# Altium schematic sheet Sheet1.SchDoc
size B
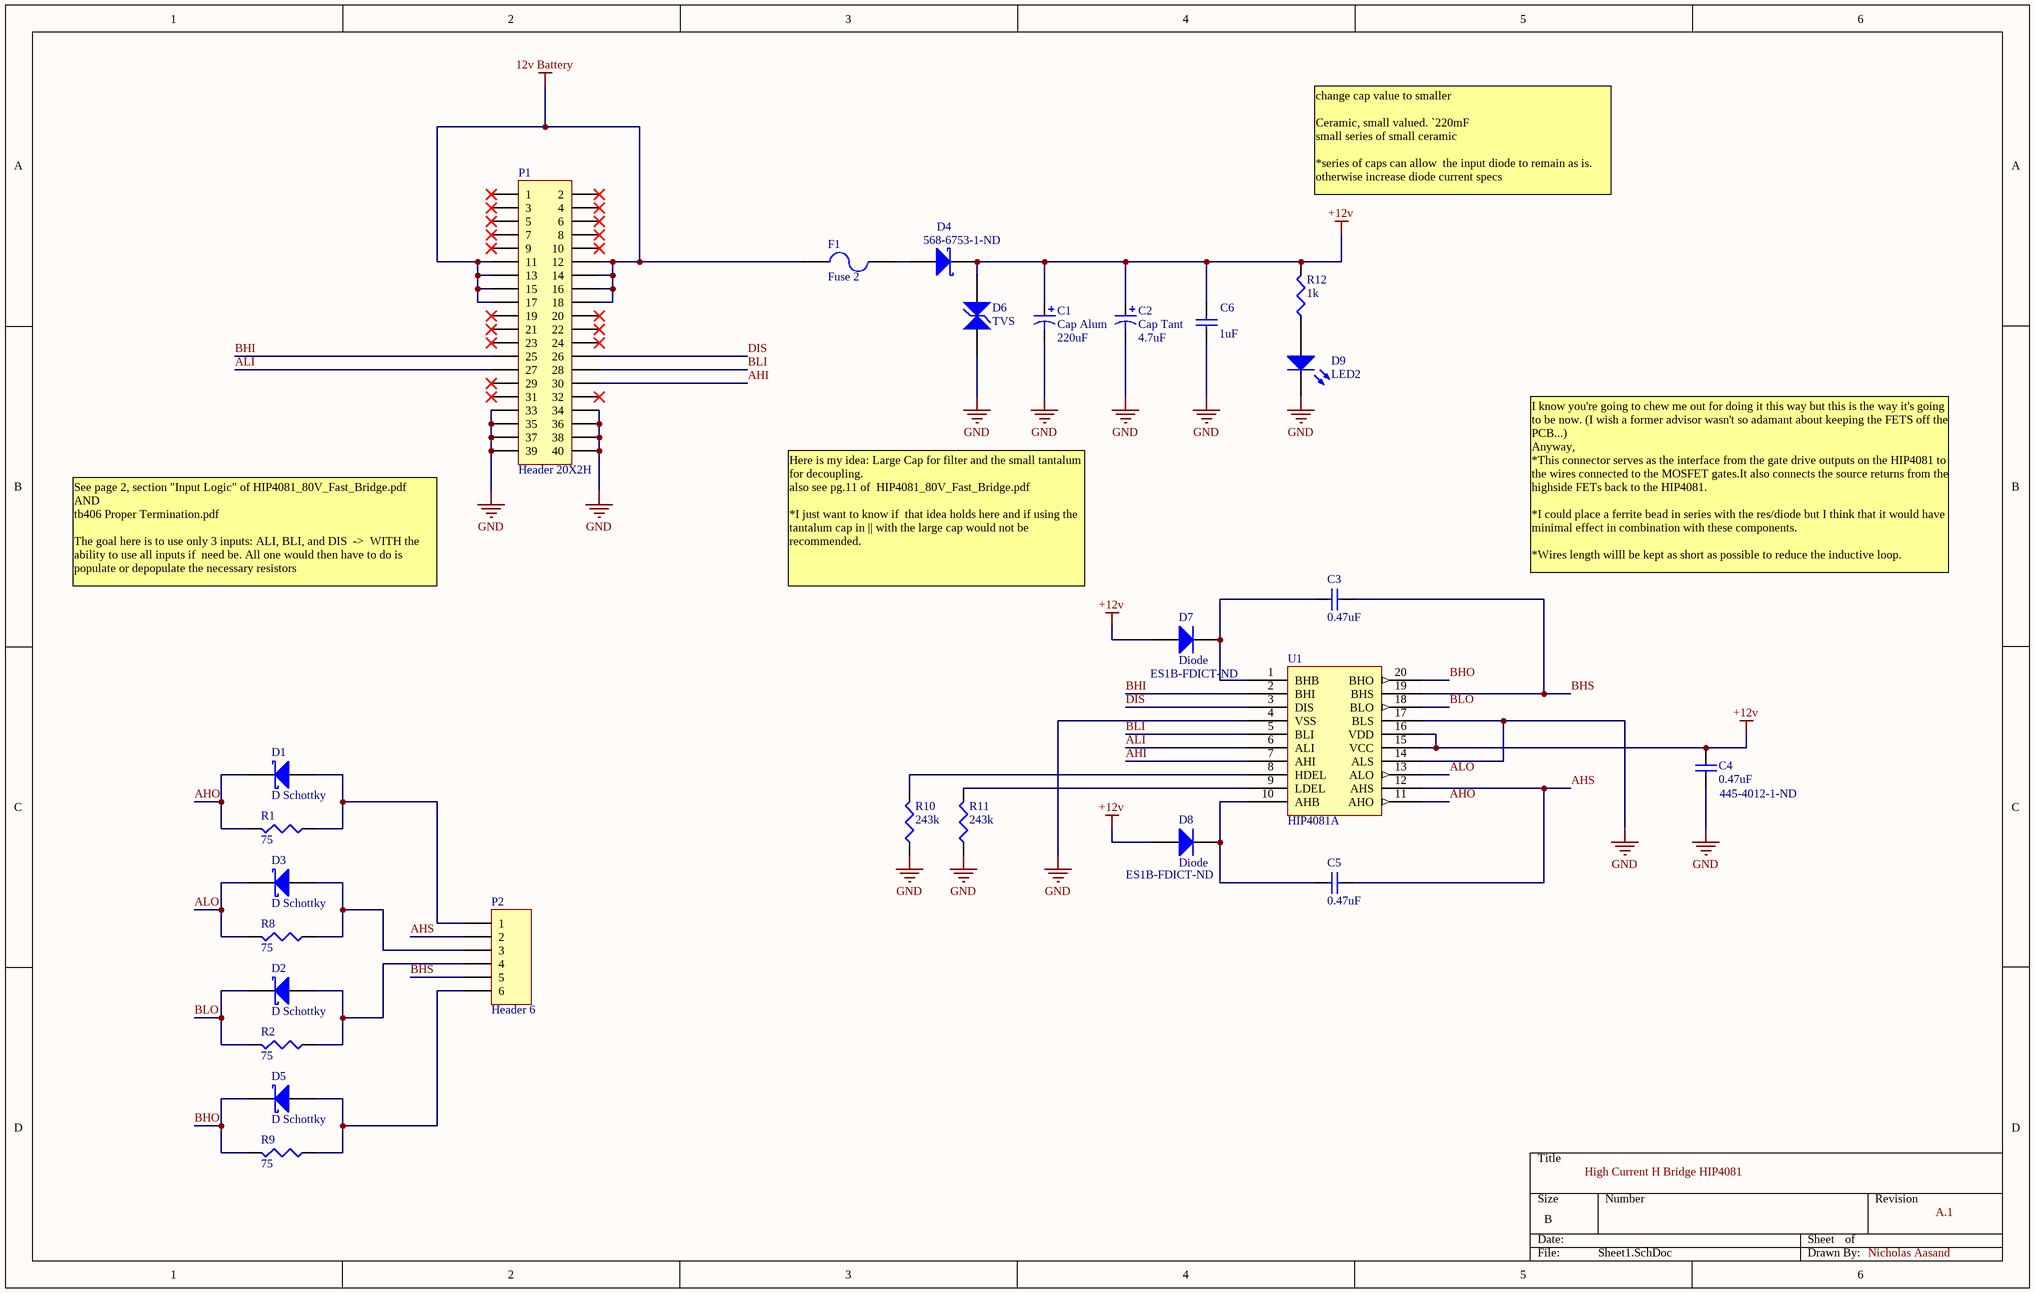
[diagram p0: Sheet1.SchDoc]

## Parts
C1  Cap Alum  value 220uF  [CAPPR3.5-8x11.5]
C2  Cap Tant  value 4.7uF  [CP1206]
C3  value 0.47uF  [C0805]  (hidden comment: 0805)
C4  value 0.47uF  Digikey: 445-4012-1-ND  [C1206]  (hidden comment: 0805)
C5  value 0.47uF  [C0805]  (hidden comment: 0805)
C6  value 1uF  [C0805]  (hidden comment: 0805)
D1  D Schottky  [SMB]
D2  D Schottky  [SMB]
D3  D Schottky  [SMB]
D4  Digikey: 568-6753-1-ND  [SOD128]  (hidden comment: PMEG3030EP,115)
D5  D Schottky  [SMB]
D6  TVS  [DSO-C2/X3.3]
D7  Diode  Digikey: ES1B-FDICT-ND  [DSO-C2/G1.6]
D8  Diode  Digikey: ES1B-FDICT-ND  [DSO-C2/G1.6]
D9  LED2  [C0805]
F1  Fuse 2  [3550-2 ATC Fuse Holder]
P1  Header 20X2H  [HDR2X20H]
P2  Header 6  [B6PS-VH]
R1  value 75  [RESC3216N]  (hidden comment: 1206)
R2  value 75  [RESC3216N]  (hidden comment: 1206)
R8  value 75  [RESC3216N]  (hidden comment: 1206)
R9  value 75  [RESC3216N]  (hidden comment: 1206)
R10  value 243k  [C1206]  (hidden comment: 1206)
R11  value 243k  [C1206]  (hidden comment: 1206)
R12  value 1k  [RESC3216N]  (hidden comment: 1206)
U1  HIP4081A  [SOIC127P1030-20M]

## Nets
12v Battery: F1.1 P1.11 P1.12 P1.13 P1.14 P1.15 P1.16 P1.17 P1.18
+12v: C1.1 C2.1 C4.1 C6.2 D4.2(K) D6.1 D7.1(A) D8.1(A) R12.2 U1.15(VCC) U1.16(VDD)
GND: C1.2 C2.2 C4.2 C6.1 D6.2 D9.2(K) P1.33 P1.34 P1.35 P1.36 P1.37 P1.38 P1.39 P1.40 R10.1 R11.1 U1.4(VSS) U1.14(ALS) U1.17(BLS)
AHI: P1.30 U1.7(AHI)
AHO: D1.2(K) R1.2 U1.11(AHO)
AHS: C5.1 P2.2 U1.12(AHS)
ALI: P1.27 U1.6(ALI)
ALO: D3.2(K) R8.2 U1.13(ALO)
BHI: P1.25 U1.2(BHI)
BHO: D5.2(K) R9.2 U1.20(BHO)
BHS: C3.1 P2.5 U1.19(BHS)
BLI: P1.28 U1.5(BLI)
BLO: D2.2(K) R2.2 U1.18(BLO)
DIS: P1.26 U1.3(DIS)
NetC3_2: C3.2 D7.2(K) U1.1(BHB)
NetC5_2: C5.2 D8.2(K) U1.10(AHB)
NetD1_1: D1.1(A) P2.1 R1.1
NetD2_1: D2.1(A) P2.4 R2.1
NetD3_1: D3.1(A) P2.3 R8.1
NetD4_1: D4.1(A) F1.2
NetD5_1: D5.1(A) P2.6 R9.1
NetD9_1: D9.1(A) R12.1
NetR10_2: R10.2 U1.8(HDEL)
NetR11_2: R11.2 U1.9(LDEL)

Not connected (* = marked no-connect by the designer): P1 1* 2* 3* 4* 5* 6* 7* 8* 9* 10* 19* 20* 21* 22* 23* 24* 29* 31* 32*

## Notes on the sheet
- change cap value to smaller
  Ceramic, small valued. `220mF
  small series of small ceramic
  *series of caps can allow  the input diode to remain as is.
  otherwise increase diode current specs
- I know you're going to chew me out for doing it this way but this is the way it's going to be now. (I wish a former advisor wasn't so adamant about keeping the FETS off the PCB...)
  Anyway,
  *This connector serves as the interface from the gate drive outputs on the HIP4081 to the wires connected to the MOSFET gates.It also connects the source returns from the highside FETs back to the HIP4081.
  *I could place a ferrite bead in series with the res/diode but I think that it would have minimal effect in combination with these components.
  *Wires length willl be kept as short as possible to reduce the inductive loop.
- See page 2, section "Input Logic" of HIP4081_80V_Fast_Bridge.pdf
  AND
  tb406 Proper Termination.pdf
  The goal here is to use only 3 inputs: ALI, BLI, and DIS  ->  WITH the ability to use all inputs if  need be. All one would then have to do is populate or depopulate the necessary resistors
- Here is my idea: Large Cap for filter and the small tantalum for decoupling.
  also see pg.11 of  HIP4081_80V_Fast_Bridge.pdf
  *I just want to know if  that idea holds here and if using the tantalum cap in || with the large cap would not be recommended.
- High Current H Bridge HIP4081
- A.1
- Nicholas Aasand

## Library data of the parts
C1 = Cap Pol1: Polarized Capacitor (Radial); Published: 8-Jun-2000; LatestRevisionDate: 17-Jul-2002; LatestRevisionNote: Re-released for DXP Platform.; PackageReference: CAPPR5-10x25; Publisher: Altium Limited; PackageDescription: Polarized Capacitor (Radial); 2 Leads; Digikey: P12383-ND
C2 = Cap Pol3: Polarized Capacitor (Surface Mount); Published: 8-Jun-2000; LatestRevisionDate: 29-May-2009; LatestRevisionNote: IPC-7351 Footprint Added.; PackageReference: C0805; Publisher: Altium Limited; PackageDescription: Chip Capacitor; Digikey: 399-10128-1-ND
C3-C6 = Cap Semi: Capacitor (Semiconductor SIM Model); Published: 8-Jun-2000; LatestRevisionDate: 29-May-2009; LatestRevisionNote: IPC-7351 Footprint Added.; Publisher: Altium Limited; PackageDescription: Chip Capacitor
  C3 C5: PackageReference: C0805; Digikey: 445-6803-1-ND
  C4: PackageReference: C1206
  C6: PackageReference: C1206; Digikey: 311-1358-1-ND
D1-D3 D5 = D Schottky: Schottky Diode; Published: 8-Jun-2000; LatestRevisionDate: 17-Jul-2002; LatestRevisionNote: Re-released for DXP Platform.; PackageReference: SMB; Publisher: Altium Limited; PackageDescription: DO-214-AA/SMB; 2 C-Bend Leads; Body 5.3 x 3.6 mm, inc. leads (LxW); Code_JEDEC: DO-214-AA; Digikey: B160B-FDICT-ND
D4 = D Schottky: Published: 8-Jun-2000; LatestRevisionDate: 17-Jul-2002; LatestRevisionNote: Re-released for DXP Platform.; PackageReference: SMB; Publisher: Altium Limited; PackageDescription: DO-214-AA/SMB; 2 C-Bend Leads; Body 5.3 x 3.6 mm, inc. leads (LxW); Code_JEDEC: DO-214-AA
D6 = TVS_Bi: Bi-directional TVS diode; Digikey: SMCJ22CAFSCT-ND
D7 D8 = Diode: Default Diode; Published: 8-Jun-2000; LatestRevisionDate: 17-Jul-2002; LatestRevisionNote: Re-released for DXP Platform.; PackageVersion: Sep-1996; PackageReference: SMA; Publisher: Altium Limited; Code_JEDEC: DO-214-AC
D9 = LED2: Ultra Bright YELLOW ORANGE AlInGaP LED; Published: 8-Jun-2000; LatestRevisionDate: 17-Jul-2002; LatestRevisionNote: Re-released for DXP Platform.; PackageVersion: Feb-2002; PackageReference: C0805; Publisher: Altium Limited; PackageDescription: SM LED; 2 Flat Leads; Digikey: 160-1413-1-ND
F1 = Fuse 2: Fuse; Published: 8-Jun-2000; LatestRevisionDate: 17-Jul-2002; LatestRevisionNote: Re-released for DXP Platform.; PackageReference: PIN-W2/E2.8; Publisher: Altium Limited; PackageDescription: Thru-Hole; 2 Leads
P1 = Header 20X2H: Header, 20-Pin, Dual row, Right Angle; LatestRevisionDate: 17-Jul-2002; LatestRevisionNote: Re-released for DXP Platform.; Publisher: Altium Limited
P2 = Header 6: Header, 6-Pin; LatestRevisionDate: 17-Jul-2002; LatestRevisionNote: Re-released for DXP Platform.; Publisher: Altium Limited
R1 R2 R8-R12 = Res3: Resistor
  R1 R2 R8 R9: Digikey: 311-75ERCT-ND
  R10 R11: Digikey: 541-243KFCT-ND
  R12: Digikey: 311-1.0KERCT-ND
U1 = HIP4081A: 80V/2.5A Peak, High Frequency Full Bridge FET Driver; Digikey: HIP4081AIBZTCT-ND